# Altium schematic sheet inamp.SchDoc
size A4; Organization: Medical Technologies CZ a.s.; SheetNumber: 7; SheetTotal: 10; Version1: N/A; Version2: N/A; Version3: N/A; Change1description: N/A; Change2description: N/A; Change3description: N/A; Change1DrawnBy: N/A; Change2DrawnBy: N/A; Change3DrawnBy: N/A; Change1CheckedBy: N/A; Change2CheckedBy: N/A; Change3CheckedBy: N/A; PreviusVersion_Chng1: N/A; PreviusVersion_Chng2: N/A; PreviusVersion_Chng3: N/A; Variant1description: Standard assembly; Variant2description: N/A; Variant3description: N/A; Variant4description: N/A; PrimaryCard1: XXXxxxXXX; PrimaryCard2: N/A; PrimaryCard3: N/A; PrimaryCard4: N/A; SPICEModelCacheOITHGSGB: <root> / <DocumentId>OITHGSGB</DocumentId> / <CacheFrame Number="0"> / <Model Name="cl32b106kbjnnn" Kind="CKT"> / <Text>* CL32B106KBJNNN Multilayer Ceramic Capacitor Spice Model / *----------------------------------------------------------------------------------------------- / * Model Generated by Samsung Electro-Mechanics / * Samsung Spice Model Version 4.0 / * Products : Multilayer Ceramic Capacitor(General) / *----------------------------------------------------------------------------------------------- / * Characteristics : / * / *     Nominal Capacitance = 10uF / *     Capacitance Tolerance = +/-10% / *     TCC = X7R(-55 ~ +125 Cels.) / *     Rated Voltage = 50Vdc / *     Size = 1210(unit:inch), 3225(unit:mm) / *     Length = 3.20 +/-0.30 mm / *     Width = 2.50 +/-0.20 mm / *     Thickness = 2.50 +/-0.20 mm / *     Measurement Temperature : 25Cels. / *     DC bias Value = 0V / *     Frequency : 100Hz ~ 6GHz / *----------------------------------------------------------------------------------------------- / * External Node Assignments : / * / *  1  o---||---o  2 / * / *----------------------------------------------------------------------------------------------- / .SUBCKT CL32B106KBJNNN 1 2 / C1 1 3 9.44968E-06 / C16 17 18 2.53303E-04 / C17 18 19 4.31538E-04 / C18 19 20 3.87143E-03 / C19 20 21 4.05486E-04 / C2 3 4 3.89833E-04 / C20 21 22 2.20709E-04 / C21 22 23 2.77761E-04 / C22 23 24 2.53303E-04 / C23 24 25 1.34605E-05 / C24 25 26 2.30531E-05 / C25 26 27 1.16610E-06 / C26 27 28 4.91406E-11 / C27 28 2 4.09488E-11 / C3 4 5 5.39533E-04 / C4 5 6 5.73260E-04 / C5 6 7 5.11364E-04 / C6 7 8 1.93016E-04 / C7 8 9 1.00000E-10 / C8 9 10 1.00000E-10 / R1 1 3 1.00000E+08 / R11 12 13 2.42949E-02 / R12 13 14 9.10435E-02 / R13 14 15 1.00000E-06 / R14 15 16 1.00000E-06 / R15 16 17 1.00000E-06 / R16 17 18 1.00000E-06 / R17 18 19 7.62309E-04 / R18 19 20 1.20099E-04 / R19 20 21 5.28440E-04 / R2 3 4 3.45620E+00 / R20 21 22 1.50623E-04 / R21 22 23 4.44357E-05 / R22 23 24 1.00000E-06 / R23 24 25 1.36432E-02 / R24 25 26 6.31685E-03 / R25 26 27 1.00465E-02 / R26 27 28 2.29510E+00 / R27 28 2 6.94002E-01 / R3 4 5 3.47991E-01 / R4 5 6 4.97604E-02 / R5 6 7 9.12642E-03 / R6 7 8 2.25502E-03 / R7 8 9 1.00000E-06 / R8 9 10 1.00000E-06 / R9 10 11 1.05460E-03 / L10 11 12 1.83919E-10 / L11 12 13 2.29964E-10 / L12 13 14 6.97785E-11 / L13 14 15 1.00000E-10 / L14 15 16 1.00000E-10 / L15 16 17 1.00000E-10 / L16 17 18 1.00000E-10 / L17 18 19 1.39420E-10 / L18 19 20 1.12292E-11 / L19 20 21 4.19321E-11 / L20 21 22 4.59803E-11 / L21 22 23 1.53628E-11 / L22 23 24 1.00000E-10 / L23 24 25 1.99071E-10 / L24 25 26 4.97469E-11 / L25 26 27 3.21804E-10 / L26 27 28 6.99616E-11 / L27 28 2 2.09205E-11 / .ENDS CL32B106KBJNNN</Text> / </Model> / <Model Name="bat54" Kind="CKT"> / <Text>* / .SUBCKT BAT54 1 2 3 / * The Resistor R1 does not reflect / * a physical device.  Instead it / * improves modeling in the reverse / * mode of operation. / * / R1 1 3 3.6E+07 / R2 2 3 3.6E+07 / D1 1 3 BAT54 / D2 3 2 BAT54 / * / .MODEL BAT54 D( / +    IS = 2.117E-07 / +    N = 1.016 / +    BV = 36 / +    IBV = 1.196E-06 / +    RS = 2.637 / +    CJO = 1.114E-11 / +    VJ = 0.2013 / +    M = 0.3868 / +    FC = 0 / +    TT = 0 / +    EG = 0.69 / +    XTI = 2) / * / .ENDS</Text> / </Model> / <Model Name="cl21c221jbannn" Kind="CKT"> / <Text>* CL21C221JBANNN Multilayer Ceramic Capacitor Spice Model / *----------------------------------------------------------------------------------------------- / * Model Generated by Samsung Electro-Mechanics / * Samsung Spice Model Version 4.0 / * Products : Multilayer Ceramic Capacitor(General) / *----------------------------------------------------------------------------------------------- / * Characteristics : / * / *     Nominal Capacitance = 220pF / *     Capacitance Tolerance = +/-5% / *     TCC = C0G(-55 ~ +125 Cels.) / *     Rated Voltage = 50Vdc / *     Size = 0805(unit:inch), 2012(unit:mm) / *     Length = 2.00 +/-0.10 mm / *     Width = 1.25 +/-0.10 mm / *     Thickness = 0.65 +/-0.10 mm / *     Measurement Temperature : 25Cels. / *     DC bias Value = 0V / *     Frequency : 10000000Hz ~ 20GHz / *----------------------------------------------------------------------------------------------- / * External Node Assignments : / * / *  1  o---||---o  2 / * / *----------------------------------------------------------------------------------------------- / .SUBCKT CL21C221JBANNN 1 2 / C1 1 3 2.20000E-10 / C2 4 9 2.13740E-10 / L1 4 5 7.94570E-11 / L2 5 6 4.09420E-11 / L3 6 7 5.74380E-11 / L4 7 8 7.76920E-12 / L5 2 8 3.17500E-10 / R1 1 3 1.00000E+11 / R2 3 4 3.90940E-02 / R3 5 9 5.49330E-01 / R4 5 6 1.49620E-02 / R5 6 7 1.28550E-01 / R6 7 8 1.65170E+00 / .ENDS CL21C221JBANNN</Text> / </Model> / </CacheFrame> / </root>; DocumentName: Docname
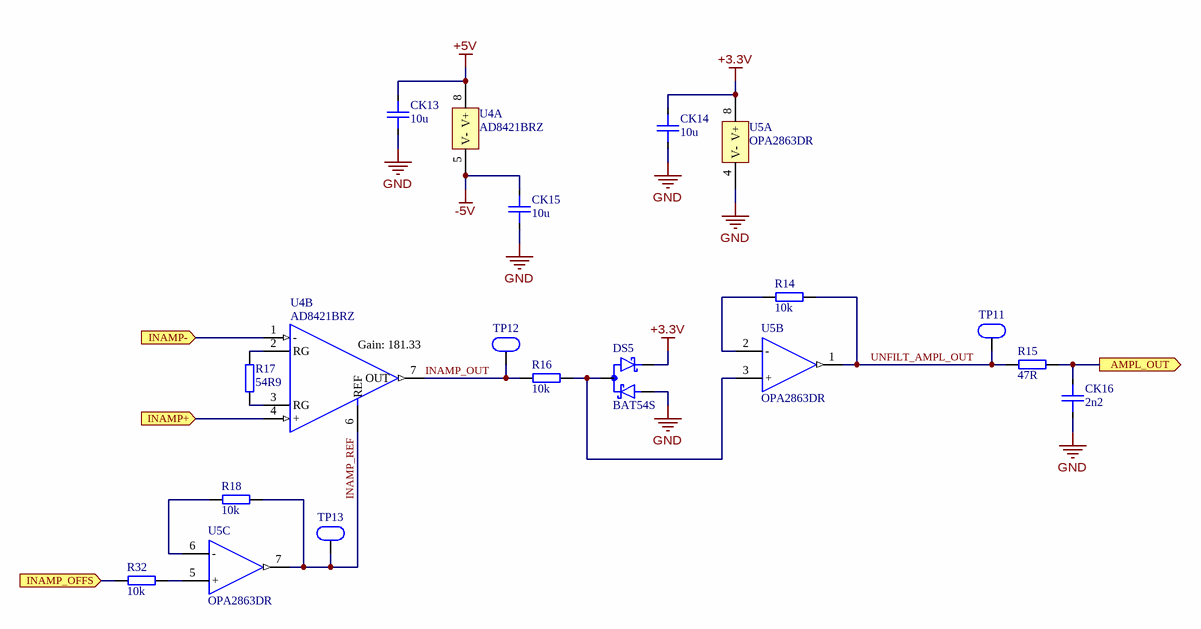
[diagram p0: inamp.SchDoc]

## Parts
CK13  10u  [CAPC3225X27N(SMC1210)]
CK14  10u  [CAPC3225X27N(SMC1210)]
CK15  10u  [CAPC3225X27N(SMC1210)]
CK16  2n2  [CAPC2012X14N(SMC0805)]
DS5  BAT54S  [SOT95P230X110-3N(SOT23)]
R14  10k  [RESC2012X06N(SMR0805)]
R15  47R  [RESC2012X06N(SMR0805)]
R16  10k  [RESC2012X06N(SMR0805)]
R17  54R9  [RESC1608X06N(SMR0603)]
R18  10k  [RESC2012X06N(SMR0805)]
R32  10k  [RESC2012X06N(SMR0805)]
TP11  Test Point  [SMD_Testpoint_Onelayer]  (value not drawn)
TP12  Test Point  [SMD_Testpoint_Onelayer]  (value not drawn)
TP13  Test Point  [SMD_Testpoint_Onelayer]  (value not drawn)
U4  AD8421BRZ  [SOIC127P600X175-8N(SOIC_8)]  (parts A,B of 2)
U5  OPA2863DR  [SOIC127P600X175-8N(SOIC_8)]  (parts A,B,C of 3)

## Ports
AMPL_OUT (out), INAMP+ (in), INAMP- (in), INAMP_OFFS (in)

## Nets
+3.3V: CK14.1 DS5.2(C2) U5.8(V+)
+5V: CK13.1 U4.8(V+)
-5V: CK15.1 U4.5(V-)
GND: CK13.2 CK14.2 CK15.2 CK16.2 DS5.1(A1) U5.4(V-)
AMPL_OUT: CK16.1 R15.1 ; port AMPL_OUT
INAMP+: U4.4(+) ; port INAMP+
INAMP-: U4.1(-) ; port INAMP-
INAMP_OFFS: R32.2 ; port INAMP_OFFS
INAMP_OUT: R16.2 TP12.1 U4.7(OUT)
INAMP_REF: R18.1 TP13.1 U4.6(REF) U5.7(OUT2)
UNFILT_AMPL_OUT: R14.1 R15.2 TP11.1 U5.1(OUT1)
NetDS5_3: DS5.3(C1A2) R16.1 U5.3(+)
NetR14_2: R14.2 U5.2(-)
NetR17_1: R17.1 U4.3(RG)
NetR17_2: R17.2 U4.2(RG)
NetR18_2: R18.2 U5.6(-)
NetR32_1: R32.1 U5.5(+)

## Notes on the sheet
- (near U4) Gain: 181.33
- Číslo výkresu /drawing number/:
- Nazev listu/sheet name/:
- DPS projekt/PCB project/:
- Kreslil /drawn by/ :
- Kontroloval /checked by/:
- Datum /date/:
- List /sheet/:
- /

## Library data of the parts
CK13-CK15 = ECK+10U50VXX0: C; 10u; 50V; 10%; X7R; ??;; Manufacturer: Murata: GRM32ER71H106KA12L;;Samsung Electro-mechanics: CL32B106KBJNNNE; Note: X7R, 9uF @ 10V, 5uF @ 30V, 2.5uF @ 50V; Component_Class: Capacitor; Status_I: Production; Status_II: Active; Tolerance_Pct: 10; Voltage_Rating_V: 50; Capacitance_F: 1E-5; KK: ECK+10U50VXX0; Value: 10u; SMD: 1; ComponentLink2URL: I:\DataSheets\ECK+10U50VXX0_MurataEN100.pdf; ComponentLink2Description: ECK+10U50VXX0_MurataEN100.pdf; ComponentLink3URL: I:\DataSheets\ECK+10U50VXX0_SamsungEN100.pdf; ComponentLink3Description: ECK+10U50VXX0_SamsungEN100.pdf; Dielectric_Type: X7R; ComponentLink1URL: heliosgreen://v1/hegMT/5-MT/Classes(343)/Folders/OpenForm?RecordNumbers=[10658879]; ComponentLink1Description: Helios
CK16 = ECK+2N250VXXJ: C; 2n2; 50V; 5%; NP0/C0G; ??;; Manufacturer: SAMSUNG: CL21C222JBFNNNE;;SAMSUNG: CL21C222JBFNNNF;;SAMSUNG: CL21C222JBFNNNG; Component_Class: Capacitor; Status_I: Production; Status_II: Active; Tolerance_Pct: 5; Voltage_Rating_V: 50; Capacitance_F: 2.2E-9; KK: ECK+2N250VXXJ; Value: 2n2; SMD: 1; ComponentLink2URL: i:\datasheets\ECK+1N50VXXJ_Yageo.pdf; ComponentLink2Description: ECK+1N50VXXJ_Yageo.pdf; ComponentLink3URL: i:\datasheets\ECK+2N250VXXJ_SamsungEN100.pdf; ComponentLink3Description: ECK+2N250VXXJ_SamsungEN100.pdf; ComponentLink4URL: i:\DataSheets\ECK+2N250VXXJ_2_SamsungEN100.pdf; ComponentLink4Description: ECK+2N250VXXJ_2_SamsungEN100.pdf; Dielectric_Type: NP0/C0G; ComponentLink1URL: heliosgreen://v1/hegMT/5-MT/Classes(343)/Folders/OpenForm?RecordNumbers=[380372]; ComponentLink1Description: Helios
DS5 = EDS+BAT54SXX0: D; Schottky; 30V; 0.2A; 2x;; Manufacturer: Diotec: BAT54S;;Philips: BAT54S,235;;FAI: BAT54S;;DIODES INC: BAT54S-7-F;;NXP: BAT54S,235; Component_Class: Diode; Status_I: Production; Status_II: Active; Multiplicity: 2; Current_Rating_A: 0.2; Reverse_Voltage_Rating_V: 30; KK: EDS+BAT54SXX0; Value: BAT54S; SMD: 1; ComponentLink2URL: i:\DataSheets\EDS+BAT54SXX0_Vishay.pdf; ComponentLink2Description: EDS+BAT54SXX0_Vishay.pdf; ComponentLink3URL: i:\DataSheets\EDS+BAT54SXX0_Fairchild.pdf; ComponentLink3Description: EDS+BAT54SXX0_Fairchild.pdf; ComponentLink4URL: i:\DataSheets\EDS+BAT54SXX0_Diodes.pdf; ComponentLink4Description: EDS+BAT54SXX0_Diodes.pdf; ComponentLink5URL: I:\datasheets\EDS+BAT54SXX0_NxpEN100.pdf; ComponentLink5Description: EDS+BAT54SXX0_NxpEN100.pdf; ComponentLink6URL: I:\DataSheets\EDS+BAT54SXX0_DiotecEN100.pdf; ComponentLink6Description: EDS+BAT54SXX0_DiotecEN100.pdf; Diode_Type: Schottky; ComponentLink1URL: heliosgreen://v1/hegMT/5-MT/Classes(343)/Folders/OpenForm?RecordNumbers=[380625]; ComponentLink1Description: Helios
R14 R16 R18 R32 = ER+10K0.1WXXF: R; 10k; 0.125W; 1%; 150V; Thick Film; ±100ppm/K; 1x;; Manufacturer: VISHAY: CRCW0805 10KOHM TK100 1%;;AVX: CR21-1002F-T;;BC Components: MCU0805-50 1% P5 10k;;YAGEO: RC0805FR-0710KL;;PANASONIC: ERJ 6EN F 1002 V;;HaS Lanskroun: CMF0805 10k 1% 100ppm/K;;ASJ: CR21-1002-FL; Component_Class: Resistor; Status_I: Production; Status_II: Active; Tolerance_Pct: 1; Voltage_Rating_V: 150; Resistance_Ohm: 10000; Power_Rating_W: 0.125; Temperature_Coefficient_PPMpK: ±100; KK: ER+10K0.1WXXF; Value: 10k; SMD: 1; ComponentLink2URL: i:\DataSheets\ER+0.1WXXF_Yageo.pdf; ComponentLink2Description: ER+0.1WXXF_Yageo.pdf; Multiplicity: 1; Resistor_Type: Thick Film; ComponentLink1URL: heliosgreen://v1/hegMT/5-MT/Classes(343)/Folders/OpenForm?RecordNumbers=[381481]; ComponentLink1Description: Helios
R15 = ER+47R0.1WXXF: R; 47R; 0.125W; 1%; 150V; Thick Film; ±100ppm/K; 1x;; KK: ER+47R0.1WXXF
R17 = 54R9: R; 54R9; 62.5mW; 0.1%; 50V; Thin Film; ±25ppm/K; 1x;; Value: 54R9; ComponentLink1Description: Datasheet; ComponentLink1URL: https://bg.farnell.com/panasonic/era6aeb49r9v/res-0805-49r9-0-125w-metal-film/dp/1810372
TP11-TP13 = EJ+TESTPOINTXX0: Con; Test Point; 1x; PCB; ??; ??V; ??A; ??; Tin; Contact;; Manufacturer: Harwin: S1751-46R; Component_Class: Connector; Status_I: Production; Status_II: Active; Multiplicity: 1; KK: EJ+TESTPOINTXX0; Value: Test Point; SMD: 1; ComponentLink2URL: i:\datasheets\EJ+TESTPOINTXX0_HarwinEN100.pdf; ComponentLink2Description: EJ+TESTPOINTXX0_HarwinEN100.pdf; ComponentLink3URL: i:\datasheets\EJ+TESTPOINTXX0_BoardWareEN100.pdf; ComponentLink3Description: EJ+TESTPOINTXX0_BoardWareEN100.pdf; Mounting_Style: PCB; Connector_Family: Test Point; Plating: Tin; Connector_Part: Contact; ComponentLink1URL: heliosgreen://v1/hegMT/5-MT/Classes(343)/Folders/OpenForm?RecordNumbers=[5618398]; ComponentLink1Description: Helios; System: Connector
U4 = AD8421BRZ: High Performance, Low Power, Precision Instrumentation Amplifier
U5 = EU+OPA2863DRXX0: IC; Opamp; 2.7V; 12.6V; 2x;; Manufacturer: Texas Instruments: OPA2863DR; Note: Dual 50MHz, 105V/µs, R-to-R, Precision Op Amps;Pin to pin compatible cheaper alternative of EU+LT6221CS8XX0; Status_I: Production; Status_II: Active; Multiplicity: 2; Vmin_V: 2.7; Vmax_V: 12.6; KK: EU+OPA2863DRXX0; Value: OPA2863DR; Component_Class: IC; SMD: 1; ComponentLink2URL: I:\DataSheets\EU+OPA2863DRXX0_TexasInstrumentsEN100.pdf; ComponentLink2Description: EU+OPA2863DRXX0_TexasInstrumentsEN100.pd; IC_Type: Opamp; ComponentLink1URL: heliosgreen://v1/hegMT/5-MT/Classes(343)/Folders/OpenForm?RecordNumbers=[21742645]; ComponentLink1Description: Helios